# Altium schematic sheet RF_Connectors.SchDoc
size A; SheetNumber: 15; SheetTotal: 15
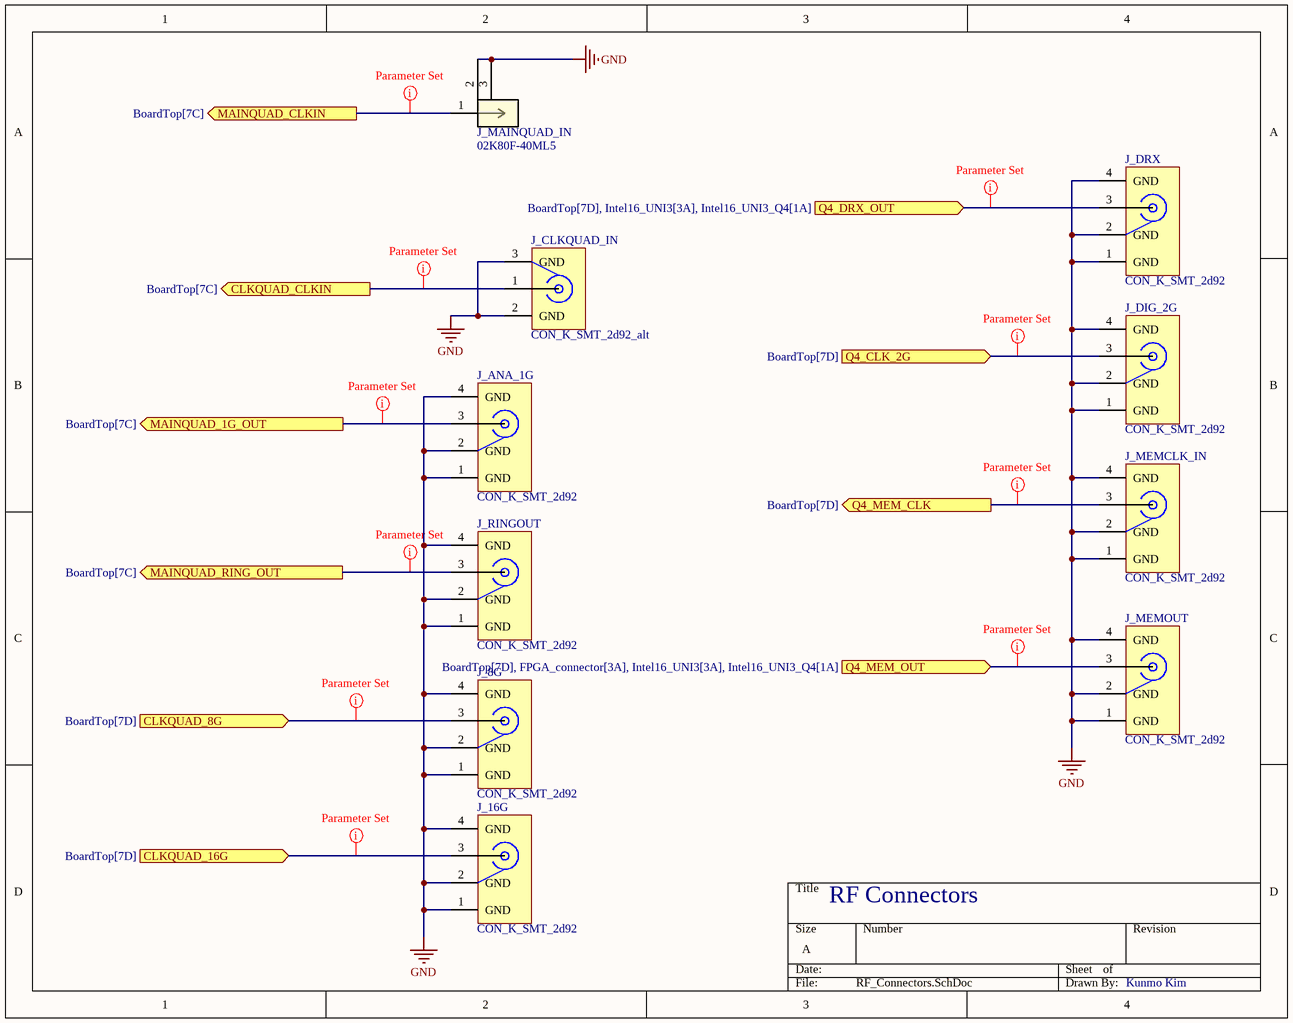
[diagram p0: RF_Connectors.SchDoc]

## Parts
J_8G  CON_K_SMT_2d92  [CON_K_SMT_2D92_3]
J_16G  CON_K_SMT_2d92  [CON_K_SMT_2D92_3]
J_ANA_1G  CON_K_SMT_2d92  [CON_K_SMT_2D92_3]
J_CLKQUAD_IN  CON_K_SMT_2d92_alt  [CON-001-SMA-ST - duplicate]
J_DIG_2G  CON_K_SMT_2d92  [CON_K_SMT_2D92_3]
J_DRX  CON_K_SMT_2d92  [CON_K_SMT_2D92_3]
J_MAINQUAD_IN  02K80F-40ML5  [CONN_02K80F-40ML5_RBG]
J_MEMCLK_IN  CON_K_SMT_2d92  [CON_K_SMT_2D92_3]
J_MEMOUT  CON_K_SMT_2d92  [CON_K_SMT_2D92_3]
J_RINGOUT  CON_K_SMT_2d92  [CON_K_SMT_2D92_3]

## Ports
CLKQUAD_8G (in, see BoardTop[7D]), CLKQUAD_16G (in, see BoardTop[7D]), CLKQUAD_CLKIN (out, see BoardTop[7C]), MAINQUAD_1G_OUT (out, see BoardTop[7C]), MAINQUAD_CLKIN (out, see BoardTop[7C]), MAINQUAD_RING_OUT (out, see BoardTop[7C]), Q4_CLK_2G (in, see BoardTop[7D]), Q4_DRX_OUT (in, see BoardTop[7D], Intel16_UNI3[3A], Intel16_UNI3_Q4[1A]), Q4_MEM_CLK (out, see BoardTop[7D]), Q4_MEM_OUT (in, see BoardTop[7D], FPGA_connector[3A], Intel16_UNI3[3A], Intel16_UNI3_Q4[1A])

## Nets
GND: J_8G.1(GND) J_8G.2(GND) J_8G.4(GND) J_16G.1(GND) J_16G.2(GND) J_16G.4(GND) J_ANA_1G.1(GND) J_ANA_1G.2(GND) J_ANA_1G.4(GND) J_CLKQUAD_IN.2(GND) J_CLKQUAD_IN.3(GND) J_DIG_2G.1(GND) J_DIG_2G.2(GND) J_DIG_2G.4(GND) J_DRX.1(GND) J_DRX.2(GND) J_DRX.4(GND) J_MAINQUAD_IN.2 J_MAINQUAD_IN.3 J_MEMCLK_IN.1(GND) J_MEMCLK_IN.2(GND) J_MEMCLK_IN.4(GND) J_MEMOUT.1(GND) J_MEMOUT.2(GND) J_MEMOUT.4(GND) J_RINGOUT.1(GND) J_RINGOUT.2(GND) J_RINGOUT.4(GND)
CLKQUAD_8G: J_8G.3 ; port CLKQUAD_8G
CLKQUAD_16G: J_16G.3 ; port CLKQUAD_16G
CLKQUAD_CLKIN: J_CLKQUAD_IN.1 ; port CLKQUAD_CLKIN
MAINQUAD_1G_OUT: J_ANA_1G.3 ; port MAINQUAD_1G_OUT
MAINQUAD_CLKIN: J_MAINQUAD_IN.1 ; port MAINQUAD_CLKIN
MAINQUAD_RING_OUT: J_RINGOUT.3 ; port MAINQUAD_RING_OUT
Q4_CLK_2G: J_DIG_2G.3 ; port Q4_CLK_2G
Q4_DRX_OUT: J_DRX.3 ; port Q4_DRX_OUT
Q4_MEM_CLK: J_MEMCLK_IN.3 ; port Q4_MEM_CLK
Q4_MEM_OUT: J_MEMOUT.3 ; port Q4_MEM_OUT

## Layout directives
net class SE50: CLKQUAD_CLKIN, MAINQUAD_1G_OUT, MAINQUAD_CLKIN, MAINQUAD_RING_OUT, Q4_CLK_2G, Q4_DRX_OUT, Q4_MEM_CLK, Q4_MEM_OUT
net class SC50_Ver2: CLKQUAD_8G, CLKQUAD_16G

## Notes on the sheet
- RF Connectors
- Kunmo Kim

## Library data of the parts
J_8G J_16G J_ANA_1G J_DIG_2G J_DRX J_MEMCLK_IN J_MEMOUT J_RINGOUT = CON_K_SMT_2d92: Con RF K
J_CLKQUAD_IN = CON_K_SMT_2d92_alt: Con RF K
J_MAINQUAD_IN = 02K80F-40ML5: No Description Available; Mfr_Name: Rosenberger; RefDes: RefDes; Type: Type